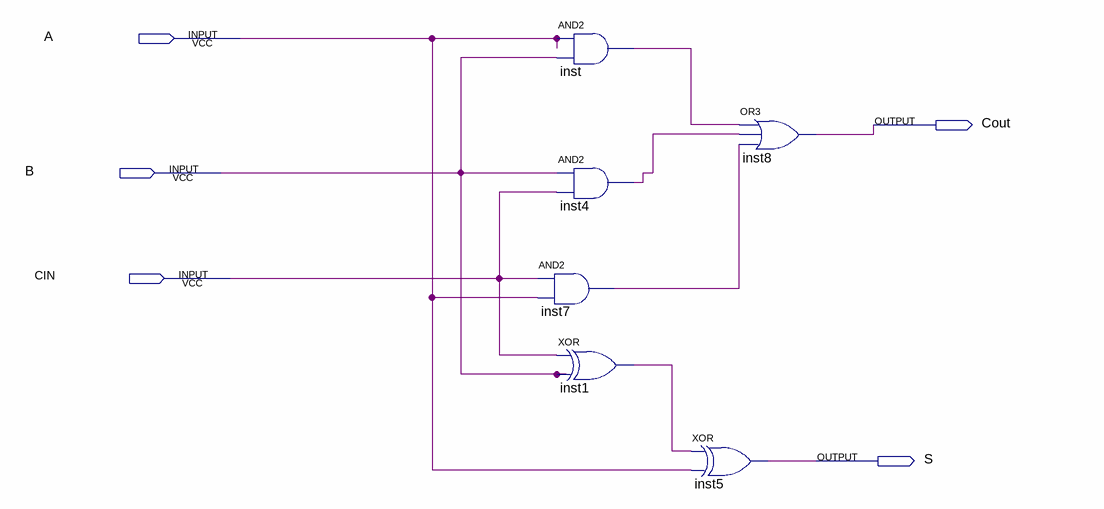
[diagram p0: schematic sheet]
// Quartus schematic FullAdder.bdf as structural Verilog: 6 symbols, 5 pins
module FullAdder (
  input  A,
  input  B,
  input  CIN,
  output Cout,
  output S
);

  wire inst1_out, inst4_out, inst7_out, inst_out;

  and inst (inst_out, A, B);
  and inst4 (inst4_out, B, CIN);
  and inst7 (inst7_out, CIN, A);
  xor inst1 (inst1_out, CIN, B);
  xor inst5 (S, inst1_out, A);
  or inst8 (Cout, inst_out, inst4_out, inst7_out);
endmodule
